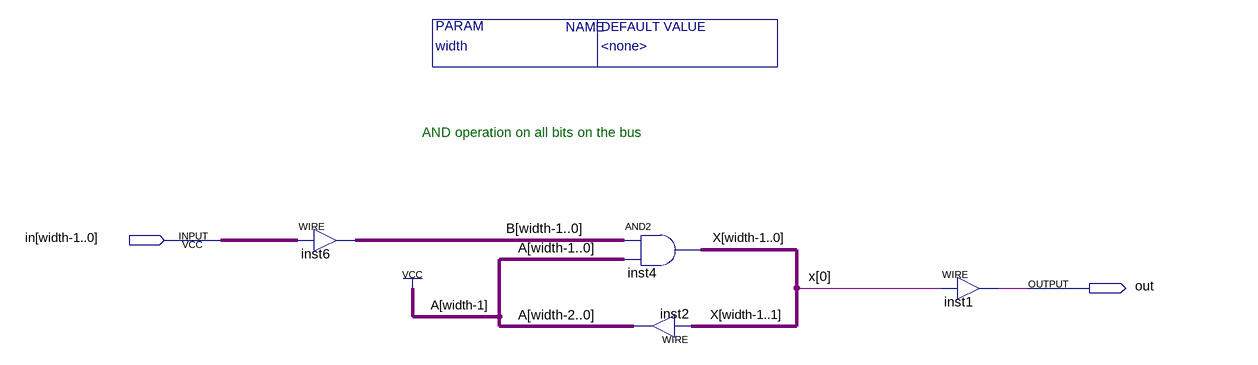
[diagram p0: schematic sheet]
// Quartus schematic wb_block_busAND.bdf as structural Verilog: 4 symbols, 2 pins
module wb_block_busAND #(parameter width = "<none>") (
  input  \in[width-1..0] ,
  output out
);

  wire \A[width-1..0] , \A[width-2..0] , \B[width-1..0] , \X[width-1..0] , \X[width-1..1] ;
  wire [0:0] x;

  assign \B[width-1..0]  = \in[width-1..0] ;  // WIRE inst6
  and inst4 (\X[width-1..0] , \B[width-1..0] , \A[width-1..0] );
  assign \A[width-2..0]  = \X[width-1..1] ;  // WIRE inst2
  assign out = x[0];  // WIRE inst1

  // Notes on the sheet:
  //   AND operation on all bits on the bus
endmodule
